# Altium schematic sheet Intermediate_LCL_Top_20230320.SchDoc
size A2; SheetNumber: 1; SheetTotal: 5
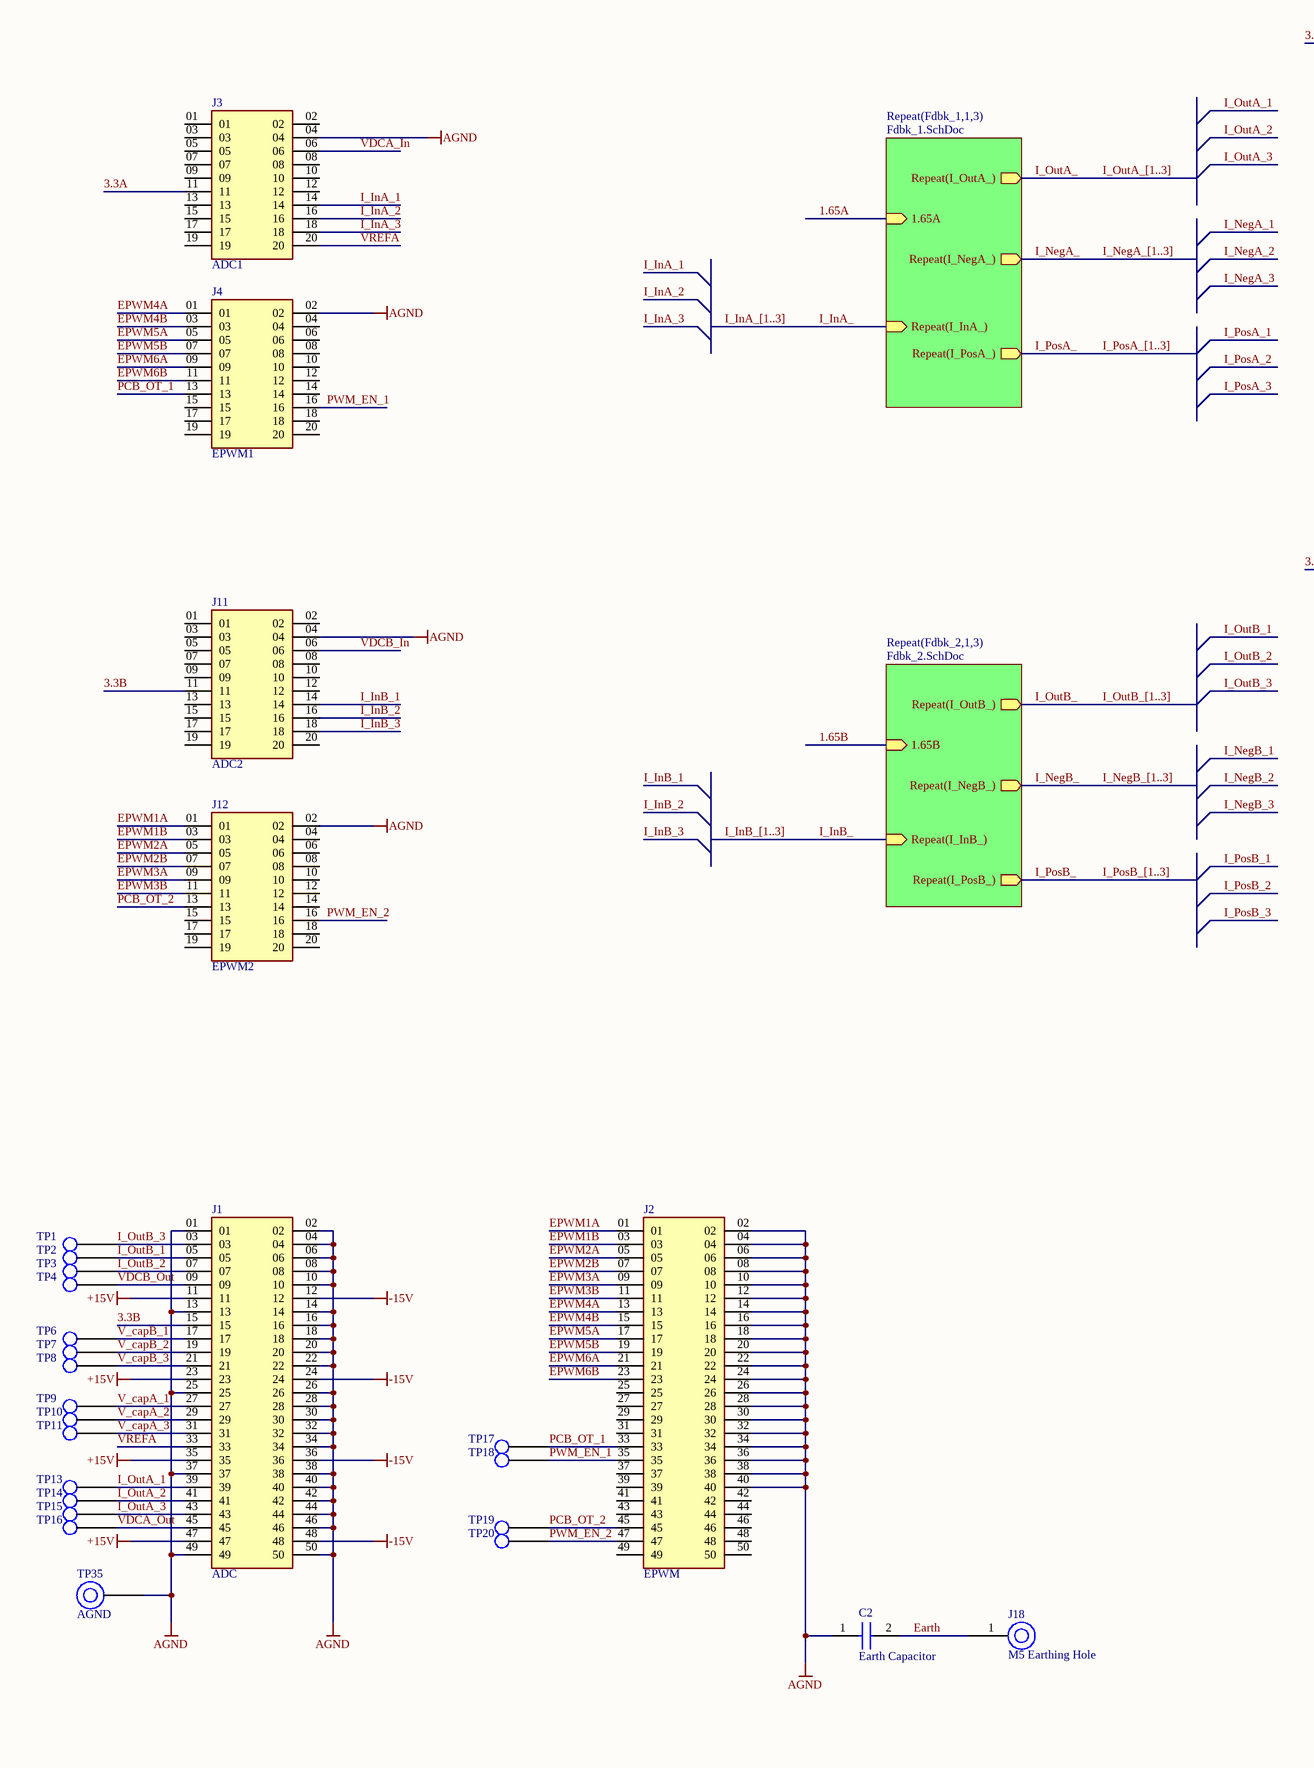
[diagram p0: Intermediate_LCL_Top_20230320.SchDoc, left]
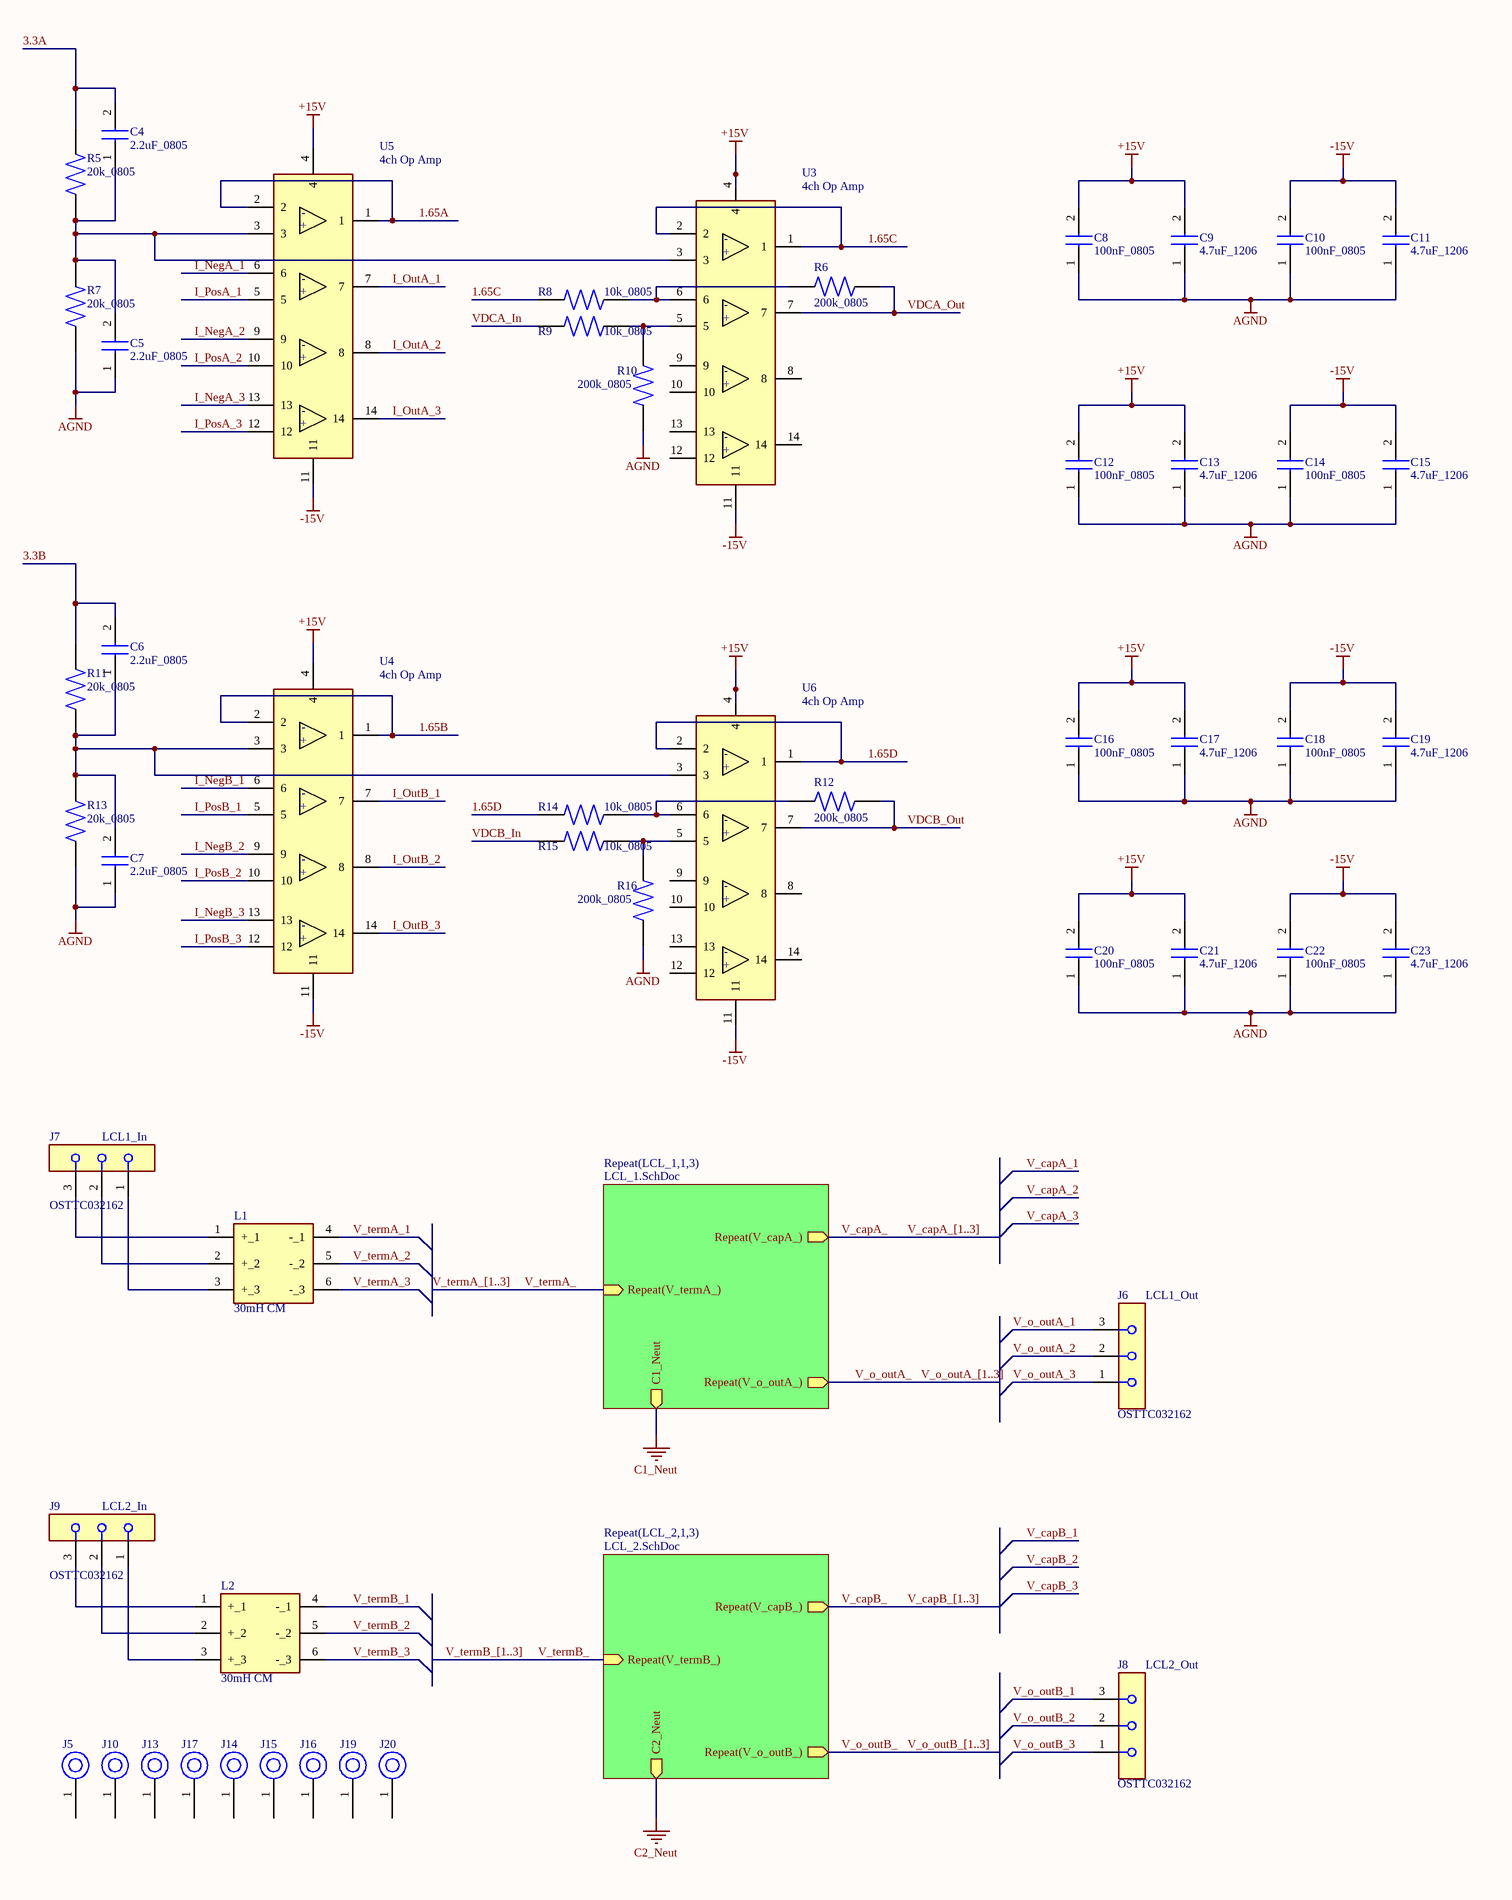
[diagram p1: Intermediate_LCL_Top_20230320.SchDoc, right]

## Parts
C2  Earth Capacitor  [RAD-0.3]
C4  2.2uF_0805  [0805 Capacitor]
C5  2.2uF_0805  [0805 Capacitor]
C6  2.2uF_0805  [0805 Capacitor]
C7  2.2uF_0805  [0805 Capacitor]
C8  100nF_0805  [0805 Capacitor]
C9  4.7uF_1206  [1206 Capacitor]
C10  100nF_0805  [0805 Capacitor]
C11  4.7uF_1206  [1206 Capacitor]
C12  100nF_0805  [0805 Capacitor]
C13  4.7uF_1206  [1206 Capacitor]
C14  100nF_0805  [0805 Capacitor]
C15  4.7uF_1206  [1206 Capacitor]
C16  100nF_0805  [0805 Capacitor]
C17  4.7uF_1206  [1206 Capacitor]
C18  100nF_0805  [0805 Capacitor]
C19  4.7uF_1206  [1206 Capacitor]
C20  100nF_0805  [0805 Capacitor]
C21  4.7uF_1206  [1206 Capacitor]
C22  100nF_0805  [0805 Capacitor]
C23  4.7uF_1206  [1206 Capacitor]
J1  ADC  [SHF-125-01-L-D-RA]
J2  EPWM  [SHF-125-01-L-D-RA]
J3  ADC1  [SSQ-110-03-T-D]
J4  EPWM1  [SSQ-110-03-T-D]
J5  M5 Mounting Hole  [M5 Mounting Hole]  (value not drawn)
J6  LCL1_Out  Part Number: OSTTC032162  [3 Pin Terminal]
J7  LCL1_In  Part Number: OSTTC032162  [3 Pin Terminal]
J8  LCL2_Out  Part Number: OSTTC032162  [3 Pin Terminal]
J9  LCL2_In  Part Number: OSTTC032162  [3 Pin Terminal]
J10  M5 Mounting Hole  [M5 Mounting Hole]  (value not drawn)
J11  ADC2  [SSQ-110-03-T-D]
J12  EPWM2  [SSQ-110-03-T-D]
J13  M5 Mounting Hole  [M5 Mounting Hole]  (value not drawn)
J14  M5 Mounting Hole  [M5 Mounting Hole]  (value not drawn)
J15  M5 Mounting Hole  [M5 Mounting Hole]  (value not drawn)
J16  M5 Mounting Hole  [M5 Mounting Hole]  (value not drawn)
J17  M5 Mounting Hole  [M5 Mounting Hole]  (value not drawn)
J18  M5 Earthing Hole  [M5 Earthing Hole]
J19  M5 Mounting Hole  [M5 Mounting Hole]  (value not drawn)
J20  M5 Mounting Hole  [M5 Mounting Hole]  (value not drawn)
L1  30mH CM  [CM Choke Custom]
L2  30mH CM  [CM Choke Custom]
R5  20k_0805  [0805 Resistor]
R6  200k_0805  [0805 Resistor]
R7  20k_0805  [0805 Resistor]
R8  10k_0805  [0805 Resistor]
R9  10k_0805  [0805 Resistor]
R10  200k_0805  [0805 Resistor]
R11  20k_0805  [0805 Resistor]
R12  200k_0805  [0805 Resistor]
R13  20k_0805  [0805 Resistor]
R14  10k_0805  [0805 Resistor]
R15  10k_0805  [0805 Resistor]
R16  200k_0805  [0805 Resistor]
TP1  I3  [PCB 1.32mm TestPoint]  (value not drawn)
TP2  I1  [PCB 1.32mm TestPoint]  (value not drawn)
TP3  I2  [PCB 1.32mm TestPoint]  (value not drawn)
TP4  VDC  [PCB 1.32mm TestPoint]  (value not drawn)
TP6  VC_2A  [PCB 1.32mm TestPoint]  (value not drawn)
TP7  VC_2B  [PCB 1.32mm TestPoint]  (value not drawn)
TP8  VC_2C  [PCB 1.32mm TestPoint]  (value not drawn)
TP9  VC_1A  [PCB 1.32mm TestPoint]  (value not drawn)
TP10  VC_1B  [PCB 1.32mm TestPoint]  (value not drawn)
TP11  VC_1C  [PCB 1.32mm TestPoint]  (value not drawn)
TP13  I1  [PCB 1.32mm TestPoint]  (value not drawn)
TP14  I2  [PCB 1.32mm TestPoint]  (value not drawn)
TP15  I3  [PCB 1.32mm TestPoint]  (value not drawn)
TP16  VDC  [PCB 1.32mm TestPoint]  (value not drawn)
TP17  OT1  [PCB 1.32mm TestPoint]  (value not drawn)
TP18  PWMEN1  [PCB 1.32mm TestPoint]  (value not drawn)
TP19  OT2  [PCB 1.32mm TestPoint]  (value not drawn)
TP20  PWMEN2  [PCB 1.32mm TestPoint]  (value not drawn)
TP35  AGND  [1.9mm Hole]
U3  4ch Op Amp  [SOIC-14]
U4  4ch Op Amp  [SOIC-14]
U5  4ch Op Amp  [SOIC-14]
U6  4ch Op Amp  [SOIC-14]

## Sub-sheets
Repeat(Fdbk_1,1,3) = Fdbk_1.SchDoc: 1.65A (in), Repeat(I_InA_) (in), Repeat(I_PosA_) (out), Repeat(I_OutA_) (out), Repeat(I_NegA_) (out)
Repeat(Fdbk_2,1,3) = Fdbk_2.SchDoc: 1.65B (in), Repeat(I_InB_) (in), Repeat(I_PosB_) (out), Repeat(I_OutB_) (out), Repeat(I_NegB_) (out)
Repeat(LCL_1,1,3) = LCL_1.SchDoc: Repeat(V_termA_) (in), Repeat(V_o_outA_) (out), Repeat(V_capA_) (out), C1_Neut (out)
Repeat(LCL_2,1,3) = LCL_2.SchDoc: Repeat(V_termB_) (in), Repeat(V_o_outB_) (out), Repeat(V_capB_) (out), C2_Neut (out)

## Nets
+15V: C8.2 C9.2 C12.2 C13.2 C16.2 C17.2 C20.2 C21.2 J1.11 J1.23 J1.35 J1.47 U3.4 U4.4 U5.4 U6.4
-15V: C10.2 C11.2 C14.2 C15.2 C18.2 C19.2 C22.2 C23.2 J1.12 J1.24 J1.36 J1.48 U3.11 U4.11 U5.11 U6.11
AGND: C2.1 C5.1 C7.1 C8.1 C9.1 C10.1 C11.1 C12.1 C13.1 C14.1 C15.1 C16.1 C17.1 C18.1 C19.1 C20.1 C21.1 C22.1 C23.1 J1.01 J1.02 J1.04 J1.06 J1.08 J1.10 J1.13 J1.14 J1.16 J1.18 J1.20 J1.22 J1.25 J1.26 J1.28 J1.30 J1.32 J1.34 J1.37 J1.38 J1.40 J1.42 J1.44 J1.46 J1.49 J1.50 J2.02 J2.04 J2.06 J2.08 J2.10 J2.12 J2.14 J2.16 J2.18 J2.20 J2.22 J2.24 J2.26 J2.28 J2.30 J2.32 J2.34 J2.36 J2.38 J2.40 J3.04 J4.02 J11.04 J12.02 R7.1 R10.2 R13.1 R16.2 TP35.1
C1_Neut: sheet Repeat(LCL_1,1,3)/C1_Neut
C2_Neut: sheet Repeat(LCL_2,1,3)/C2_Neut
1.65A: U5.1 U5.2 ; sheet Repeat(Fdbk_1,1,3)/1.65A
1.65B: U4.1 U4.2 ; sheet Repeat(Fdbk_2,1,3)/1.65B
1.65C: R8.1 U3.1 U3.2
1.65D: R14.1 U6.1 U6.2
3.3A: C4.2 J3.11 R5.2
3.3B: C6.2 J1.15 J11.11 R11.2
Earth: C2.2 J18.1
EPWM1A: J2.01 J12.01
EPWM1B: J2.03 J12.03
EPWM2A: J2.05 J12.05
EPWM2B: J2.07 J12.07
EPWM3A: J2.09 J12.09
EPWM3B: J2.11 J12.11
EPWM4A: J2.13 J4.01
EPWM4B: J2.15 J4.03
EPWM5A: J2.17 J4.05
EPWM5B: J2.19 J4.07
EPWM6A: J2.21 J4.09
EPWM6B: J2.23 J4.11
I_InA_: sheet Repeat(Fdbk_1,1,3)/Repeat(I_InA_)
I_InA_1: J3.14
I_InA_2: J3.16
I_InA_3: J3.18
I_InB_: sheet Repeat(Fdbk_2,1,3)/Repeat(I_InB_)
I_InB_1: J11.14
I_InB_2: J11.16
I_InB_3: J11.18
I_NegA_: sheet Repeat(Fdbk_1,1,3)/Repeat(I_NegA_)
I_NegA_1: U5.6
I_NegA_2: U5.9
I_NegA_3: U5.13
I_NegB_: sheet Repeat(Fdbk_2,1,3)/Repeat(I_NegB_)
I_NegB_1: U4.6
I_NegB_2: U4.9
I_NegB_3: U4.13
I_OutA_: sheet Repeat(Fdbk_1,1,3)/Repeat(I_OutA_)
I_OutA_1: J1.39 TP13.1 U5.7
I_OutA_2: J1.41 TP14.1 U5.8
I_OutA_3: J1.43 TP15.1 U5.14
I_OutB_: sheet Repeat(Fdbk_2,1,3)/Repeat(I_OutB_)
I_OutB_1: J1.05 TP2.1 U4.7
I_OutB_2: J1.07 TP3.1 U4.8
I_OutB_3: J1.03 TP1.1 U4.14
I_PosA_: sheet Repeat(Fdbk_1,1,3)/Repeat(I_PosA_)
I_PosA_1: U5.5
I_PosA_2: U5.10
I_PosA_3: U5.12
I_PosB_: sheet Repeat(Fdbk_2,1,3)/Repeat(I_PosB_)
I_PosB_1: U4.5
I_PosB_2: U4.10
I_PosB_3: U4.12
PCB_OT_1: J2.33 J4.13 TP17.1
PCB_OT_2: J2.45 J12.13 TP19.1
PWM_EN_1: J2.35 J4.16 TP18.1
PWM_EN_2: J2.47 J12.16 TP20.1
V_capA_: sheet Repeat(LCL_1,1,3)/Repeat(V_capA_)
V_capA_1: J1.27 TP9.1
V_capA_2: J1.29 TP10.1
V_capA_3: J1.31 TP11.1
V_capB_: sheet Repeat(LCL_2,1,3)/Repeat(V_capB_)
V_capB_1: J1.17 TP6.1
V_capB_2: J1.19 TP7.1
V_capB_3: J1.21 TP8.1
V_o_outA_: sheet Repeat(LCL_1,1,3)/Repeat(V_o_outA_)
V_o_outA_1: J6.3
V_o_outA_2: J6.2
V_o_outA_3: J6.1
V_o_outB_: sheet Repeat(LCL_2,1,3)/Repeat(V_o_outB_)
V_o_outB_1: J8.3
V_o_outB_2: J8.2
V_o_outB_3: J8.1
V_termA_: sheet Repeat(LCL_1,1,3)/Repeat(V_termA_)
V_termA_1: L1.4(-_1)
V_termA_2: L1.5(-_2)
V_termA_3: L1.6(-_3)
V_termB_: sheet Repeat(LCL_2,1,3)/Repeat(V_termB_)
V_termB_1: L2.4(-_1)
V_termB_2: L2.5(-_2)
V_termB_3: L2.6(-_3)
VDCA_In: J3.06 R9.1
VDCA_Out: J1.45 R6.1 TP16.1 U3.7
VDCB_In: J11.06 R15.1
VDCB_Out: J1.09 R12.1 TP4.1 U6.7
VREFA: J1.33 J3.20
NetC4_1: C4.1 C5.2 R5.1 R7.2 U3.3 U5.3
NetC6_1: C6.1 C7.2 R11.1 R13.2 U4.3 U6.3
NetJ7_1: J7.1 L1.3(+_3)
NetJ7_2: J7.2 L1.2(+_2)
NetJ7_3: J7.3 L1.1(+_1)
NetJ9_1: J9.1 L2.3(+_3)
NetJ9_2: J9.2 L2.2(+_2)
NetJ9_3: J9.3 L2.1(+_1)
NetR6_2: R6.2 R8.2 U3.6
NetR9_2: R9.2 R10.1 U3.5
NetR12_2: R12.2 R14.2 U6.6
NetR15_2: R15.2 R16.1 U6.5

Not connected (* = marked no-connect by the designer): J2 25 27 29 31 37 39 41 42 43 44 46 48 49 50; J3 01 02 03 05 07 08 09 10 12 13 15 17 19; J4 04 06 08 10 12 14 15 17 18 19 20; J5 1; J10 1; J11 01 02 03 05 07 08 09 10 12 13 15 17 19 20; J12 04 06 08 10 12 14 15 17 18 19 20; J13 1; J14 1; J15 1; J16 1; J17 1; J19 1; J20 1; U3 8 9 10 12 13 14; U6 8 9 10 12 13 14

## Buses and harness runs
bus I_InA_[1..3]
bus I_InB_[1..3]
bus I_NegA_[1..3]
bus I_NegB_[1..3]
bus I_OutA_[1..3]
bus I_OutB_[1..3]
bus I_PosA_[1..3]
bus I_PosB_[1..3]
bus V_capA_[1..3]
bus V_capB_[1..3]
bus V_o_outA_[1..3]
bus V_o_outB_[1..3]
bus V_termA_[1..3]
bus V_termB_[1..3]

## Notes on the sheet
- (in symbol TL074D) -; +

## Library data of the parts
C2 = 102_Y: Y Earth Capacitor; MP: C1206C120J5GACTU; Package: None; Price: None; Value: *; Availability: Unavailable
C4-C7 = C2012X5R1H225K125AB: SMD Multilayer Ceramic Capacitor, 2.2 µF, 50 V, 0805 [2012 Metric], ± 10%, X5R, C
C8 C10 C12 C14 C16 C18 C20 C22 = C0805C104J5RACTU: SMD Multilayer Ceramic Capacitor, 0.1 µF, 50 V, 0805 [2012 Metric], ± 5%, X7R, C Series KEMET
C9 C11 C13 C15 C17 C19 C21 C23 = C3216X7R1H475K160AC: SMD Multilayer Ceramic Capacitor, 4.7 µF, 50 V, 1206 [3216 Metric], ± 10%, X7R, C; MP: C1206C120J5GACTU; Package: None; Price: None; Value: *; Availability: Unavailable
J1 J2 = SHF-125-01-L-D-RA: 50-Pin Simplus Connector; MF: Samtec; MP: SHF-125-01-L-D-RA; Package: None; Price: None; Availability: Unavailable; Value: *
J3 J4 J11 J12 = SSQ-110-03-T-D: SSQ - Samtec 2.54mm Square Tail Dual Row Socket Strip 8.5mm Profile - Fast Stock; MF: Samtec Inc.; Value: *; Price: None; Availability: In Stock; SnapEDA_Link: https://www.snapeda.com/parts/SSQ-110-03-T-D/Samtec%20Inc./view-part/616109/?ref=snap; Check_prices: https://www.snapeda.com/parts/SSQ-110-03-T-D/Samtec%20Inc./view-part/616109/?ref=eda; Purchase-URL: https://pricing.snapeda.com/search/part/SSQ-110-03-T-D/?ref=eda; Package: None; MP: SSQ-110-03-T-D
J6-J9 = 3PinTerminal: 3 Position Terminal Block 5.08mm; Manufacturer: On Shore Technology; Voltage: 300V; Is Female: yes; helpURL: https://upverter.com/upn/revision/2b80058b23306b34/; ComponentLink2Description: Datasheet; Temperature: -30°C to +105°C; Package: HDR03; Supplier 2: Mouser; Price: 0.382016875697; Supplier 1: Digi-Key; ComponentLink1URL: https://upverter.com/upn/revision/2b80058b23306b34/; Supplier Part Number 1: ED2610-ND; ComponentLink1Description: Upverter; ComponentLink2URL: https://upverter.com/datasheet/d9a5d2e095ec14efdc364e45047c257fc4ca76eb.pdf; RoHS: TRUE; Temperature Range High: +105°C; Digikey Description: CONN TERM BLOCK 5.08MM VERT 3POS PCB; Digikey Part Number: ED2610-ND; Lead Free: yes; Temperature Range Low: -30°C
L1 L2 = 30mH Custom CM Choke: Manufacturer_Name: Wurth Elektronik; Manufacturer_Part_Number: 744839029220; Datasheet Link: https://componentsearchengine.com//744839029220.pdf; Height: 39mm; Mouser Part Number: 710-744839029220; Mouser Price/Stock: https://www.mouser.co.uk/ProductDetail/Wurth-Elektronik/744839029220?qs=MoCBKJu1Jj15mDhjF%2F4U%252Bg%3D%3D
R5 R7 R11 R13 = CRCW080520K0FKEA: SMD Chip Resistor, 20 kohm, ± 1%, 125 mW, 0805 [2012 Metric], Thick Film, General Purpose; MF: Bourns; MP: CRE2512-FZ-R007E-3; Mouser-Purchase-URL: https://snapeda.com/shop?store=Mouser&id=836123; Price: None; Package: 6432 Stackpole; Value: *; SnapEDA_Link: https://www.snapeda.com/parts/CRE2512-FZ-R007E-3/Bourns/view-part/836123/?ref=snap; DigiKey-Purchase-URL: https://snapeda.com/shop?store=DigiKey&id=836123; Availability: Good
R6 R10 R12 R16 = CRCW0805200KFKEA: SMD Chip Resistor, 200 kohm, ± 1%, 125 mW, 0805 [2012 Metric], Thick Film, General Purpose; MF: Bourns; MP: CRE2512-FZ-R007E-3; Mouser-Purchase-URL: https://snapeda.com/shop?store=Mouser&id=836123; Price: None; Package: 6432 Stackpole; Value: *; SnapEDA_Link: https://www.snapeda.com/parts/CRE2512-FZ-R007E-3/Bourns/view-part/836123/?ref=snap; DigiKey-Purchase-URL: https://snapeda.com/shop?store=DigiKey&id=836123; Availability: Good
R8 R9 R14 R15 = CRCW080510K0FKEA: SMD Chip Resistor, 10 kohm, ± 1%, 125 mW, 0805 [2012 Metric], Thick Film, General Purpose; MF: Bourns; MP: CRE2512-FZ-R007E-3; Mouser-Purchase-URL: https://snapeda.com/shop?store=Mouser&id=836123; Price: None; Package: 6432 Stackpole; Value: *; SnapEDA_Link: https://www.snapeda.com/parts/CRE2512-FZ-R007E-3/Bourns/view-part/836123/?ref=snap; DigiKey-Purchase-URL: https://snapeda.com/shop?store=DigiKey&id=836123; Availability: Good
TP1-TP4 TP6-TP11 TP13-TP20 = PCBTestpoint: 20-313143 PCB Test Point, White, Through Hole Mount, 1.32 mm, Phosphor Bronze, Tin Plated Contacts
TP35 = GroundTestPoint: H2182-01 PCB Test Point, PCB Mount, 1.9 mm, Brass, Tin Plated Contacts
U3-U6 = TL074D: Quad, 30-V, 3-MHz, high slew rate (13-V/µs), In to V+, JFET-input op amp